# Altium schematic sheet Sheet1.SchDoc
size A4
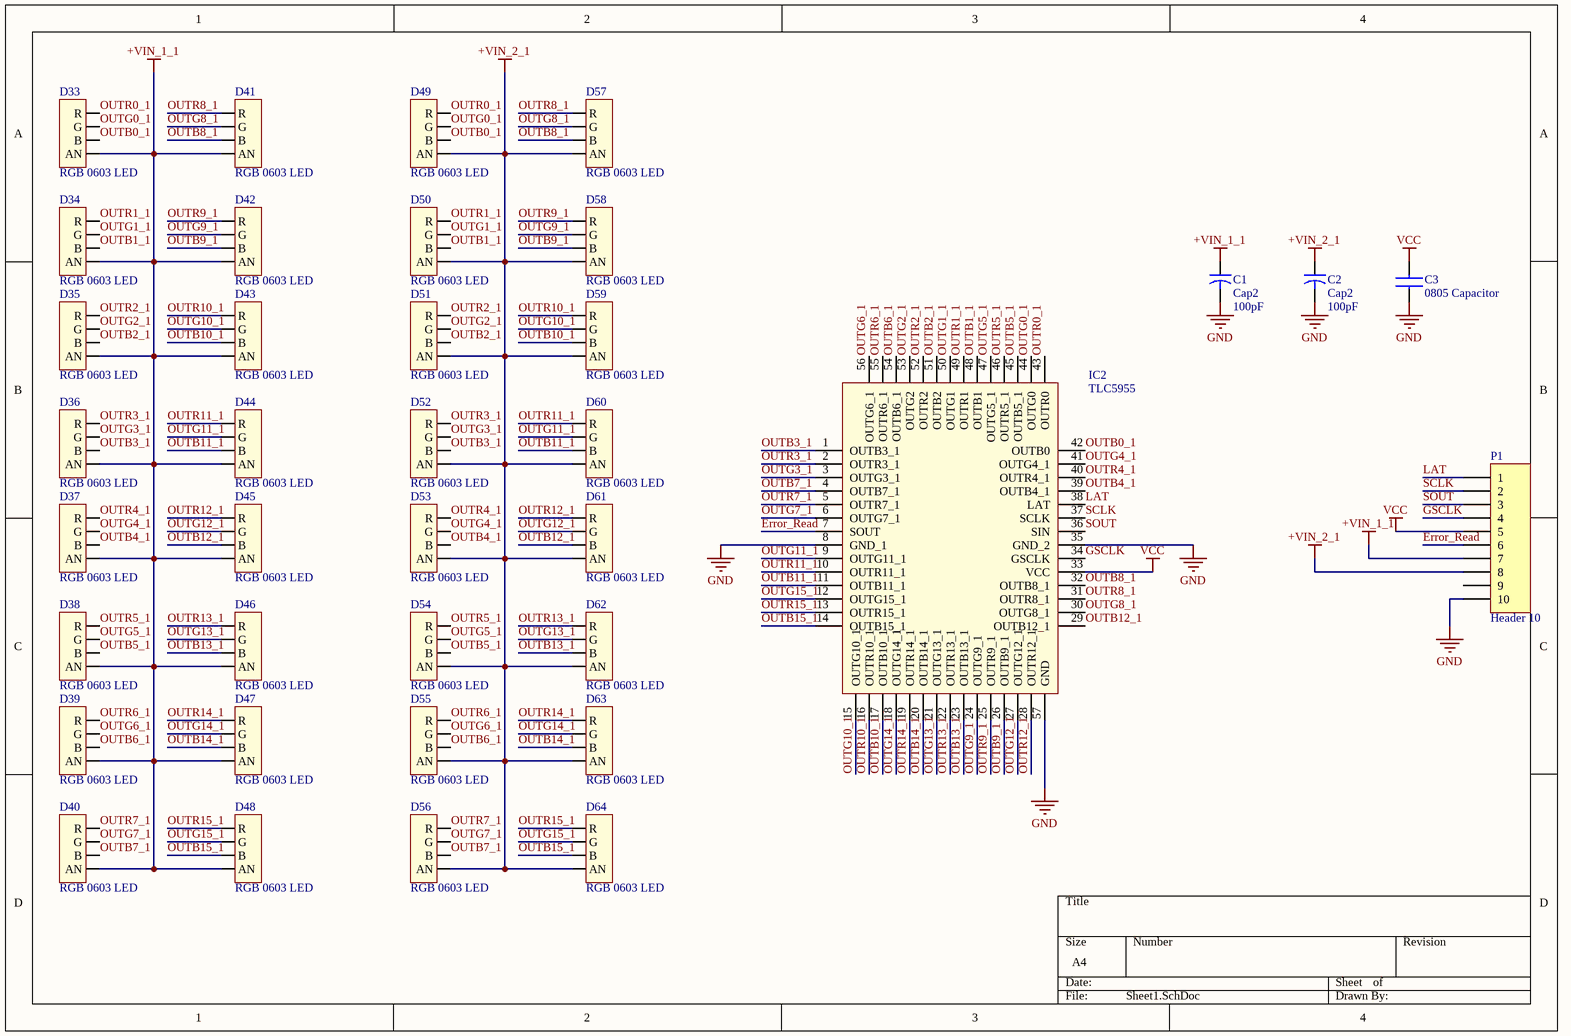
[diagram p0: Sheet1.SchDoc]

## Parts
C1  Cap2  value 100pF  [CAPR5-4X5]
C2  Cap2  value 100pF  [CAPR5-4X5]
C3  0805 Capacitor  [0805 Capacitor]
D33  RGB 0603 LED  [RGB LED]
D34  RGB 0603 LED  [RGB LED]
D35  RGB 0603 LED  [RGB LED]
D36  RGB 0603 LED  [RGB LED]
D37  RGB 0603 LED  [RGB LED]
D38  RGB 0603 LED  [RGB LED]
D39  RGB 0603 LED  [RGB LED]
D40  RGB 0603 LED  [RGB LED]
D41  RGB 0603 LED  [RGB LED]
D42  RGB 0603 LED  [RGB LED]
D43  RGB 0603 LED  [RGB LED]
D44  RGB 0603 LED  [RGB LED]
D45  RGB 0603 LED  [RGB LED]
D46  RGB 0603 LED  [RGB LED]
D47  RGB 0603 LED  [RGB LED]
D48  RGB 0603 LED  [RGB LED]
D49  RGB 0603 LED  [RGB LED]
D50  RGB 0603 LED  [RGB LED]
D51  RGB 0603 LED  [RGB LED]
D52  RGB 0603 LED  [RGB LED]
D53  RGB 0603 LED  [RGB LED]
D54  RGB 0603 LED  [RGB LED]
D55  RGB 0603 LED  [RGB LED]
D56  RGB 0603 LED  [RGB LED]
D57  RGB 0603 LED  [RGB LED]
D58  RGB 0603 LED  [RGB LED]
D59  RGB 0603 LED  [RGB LED]
D60  RGB 0603 LED  [RGB LED]
D61  RGB 0603 LED  [RGB LED]
D62  RGB 0603 LED  [RGB LED]
D63  RGB 0603 LED  [RGB LED]
D64  RGB 0603 LED  [RGB LED]
IC2  TLC5955  [TLC5955]
P1  Header 10  [HDR1X10]

## Nets
+VIN_1_1: C1.1 D33.4(AN) D34.4(AN) D35.4(AN) D36.4(AN) D37.4(AN) D38.4(AN) D39.4(AN) D40.4(AN) D41.4(AN) D42.4(AN) D43.4(AN) D44.4(AN) D45.4(AN) D46.4(AN) D47.4(AN) D48.4(AN) P1.7
+VIN_2_1: C2.1 D49.4(AN) D50.4(AN) D51.4(AN) D52.4(AN) D53.4(AN) D54.4(AN) D55.4(AN) D56.4(AN) D57.4(AN) D58.4(AN) D59.4(AN) D60.4(AN) D61.4(AN) D62.4(AN) D63.4(AN) D64.4(AN) P1.8
GND: C1.2 C2.2 C3.1 IC2.8(GND_1) IC2.35(GND_2) IC2.57(GND) P1.10
VCC: C3.2 IC2.33(VCC) P1.5
Error_Read: IC2.7(SOUT) P1.6
GSCLK: IC2.34(GSCLK) P1.4
LAT: IC2.38(LAT) P1.1
OUTB0_1: D33.3(B) D49.3(B) IC2.42(OUTB0)
OUTB1_1: D34.3(B) D50.3(B) IC2.48(OUTB1)
OUTB2_1: D35.3(B) D51.3(B) IC2.51(OUTB2)
OUTB3_1: D36.3(B) D52.3(B) IC2.1(OUTB3_1)
OUTB4_1: D37.3(B) D53.3(B) IC2.39(OUTB4_1)
OUTB5_1: D38.3(B) D54.3(B) IC2.45(OUTB5_1)
OUTB6_1: D39.3(B) D55.3(B) IC2.54(OUTB6_1)
OUTB7_1: D40.3(B) D56.3(B) IC2.4(OUTB7_1)
OUTB8_1: D41.3(B) D57.3(B) IC2.32(OUTB8_1)
OUTB9_1: D42.3(B) D58.3(B) IC2.26(OUTB9_1)
OUTB10_1: D43.3(B) D59.3(B) IC2.17(OUTB10_1)
OUTB11_1: D44.3(B) D60.3(B) IC2.11(OUTB11_1)
OUTB12_1: D45.3(B) D61.3(B) IC2.29(OUTB12_1)
OUTB13_1: D46.3(B) D62.3(B) IC2.23(OUTB13_1)
OUTB14_1: D47.3(B) D63.3(B) IC2.20(OUTB14_1)
OUTB15_1: D48.3(B) D64.3(B) IC2.14(OUTB15_1)
OUTG0_1: D33.2(G) D49.2(G) IC2.44(OUTG0)
OUTG1_1: D34.2(G) D50.2(G) IC2.50(OUTG1)
OUTG2_1: D35.2(G) D51.2(G) IC2.53(OUTG2)
OUTG3_1: D36.2(G) D52.2(G) IC2.3(OUTG3_1)
OUTG4_1: D37.2(G) D53.2(G) IC2.41(OUTG4_1)
OUTG5_1: D38.2(G) D54.2(G) IC2.47(OUTG5_1)
OUTG6_1: D39.2(G) D55.2(G) IC2.56(OUTG6_1)
OUTG7_1: D40.2(G) D56.2(G) IC2.6(OUTG7_1)
OUTG8_1: D41.2(G) D57.2(G) IC2.30(OUTG8_1)
OUTG9_1: D42.2(G) D58.2(G) IC2.24(OUTG9_1)
OUTG10_1: D43.2(G) D59.2(G) IC2.15(OUTG10_1)
OUTG11_1: D44.2(G) D60.2(G) IC2.9(OUTG11_1)
OUTG12_1: D45.2(G) D61.2(G) IC2.27(OUTG12_1)
OUTG13_1: D46.2(G) D62.2(G) IC2.21(OUTG13_1)
OUTG14_1: D47.2(G) D63.2(G) IC2.18(OUTG14_1)
OUTG15_1: D48.2(G) D64.2(G) IC2.12(OUTG15_1)
OUTR0_1: D33.1(R) D49.1(R) IC2.43(OUTR0)
OUTR1_1: D34.1(R) D50.1(R) IC2.49(OUTR1)
OUTR2_1: D35.1(R) D51.1(R) IC2.52(OUTR2)
OUTR3_1: D36.1(R) D52.1(R) IC2.2(OUTR3_1)
OUTR4_1: D37.1(R) D53.1(R) IC2.40(OUTR4_1)
OUTR5_1: D38.1(R) D54.1(R) IC2.46(OUTR5_1)
OUTR6_1: D39.1(R) D55.1(R) IC2.55(OUTR6_1)
OUTR7_1: D40.1(R) D56.1(R) IC2.5(OUTR7_1)
OUTR8_1: D41.1(R) D57.1(R) IC2.31(OUTR8_1)
OUTR9_1: D42.1(R) D58.1(R) IC2.25(OUTR9_1)
OUTR10_1: D43.1(R) D59.1(R) IC2.16(OUTR10_1)
OUTR11_1: D44.1(R) D60.1(R) IC2.10(OUTR11_1)
OUTR12_1: D45.1(R) D61.1(R) IC2.28(OUTR12_1)
OUTR13_1: D46.1(R) D62.1(R) IC2.22(OUTR13_1)
OUTR14_1: D47.1(R) D63.1(R) IC2.19(OUTR14_1)
OUTR15_1: D48.1(R) D64.1(R) IC2.13(OUTR15_1)
SCLK: IC2.37(SCLK) P1.2
SOUT: IC2.36(SIN) P1.3

Not connected (* = marked no-connect by the designer): P1 9

## Library data of the parts
C1 C2 = Cap2: Capacitor; Published: 23-Sep-2002; PackageReference: CAPR5-4X5; Publisher: Altium Limited; PackageDescription: Capacitor; 2 Leads
P1 = Header 10: Header, 10-Pin; LatestRevisionDate: 17-Jul-2002; LatestRevisionNote: Re-released for DXP Platform.; Publisher: Altium Limited